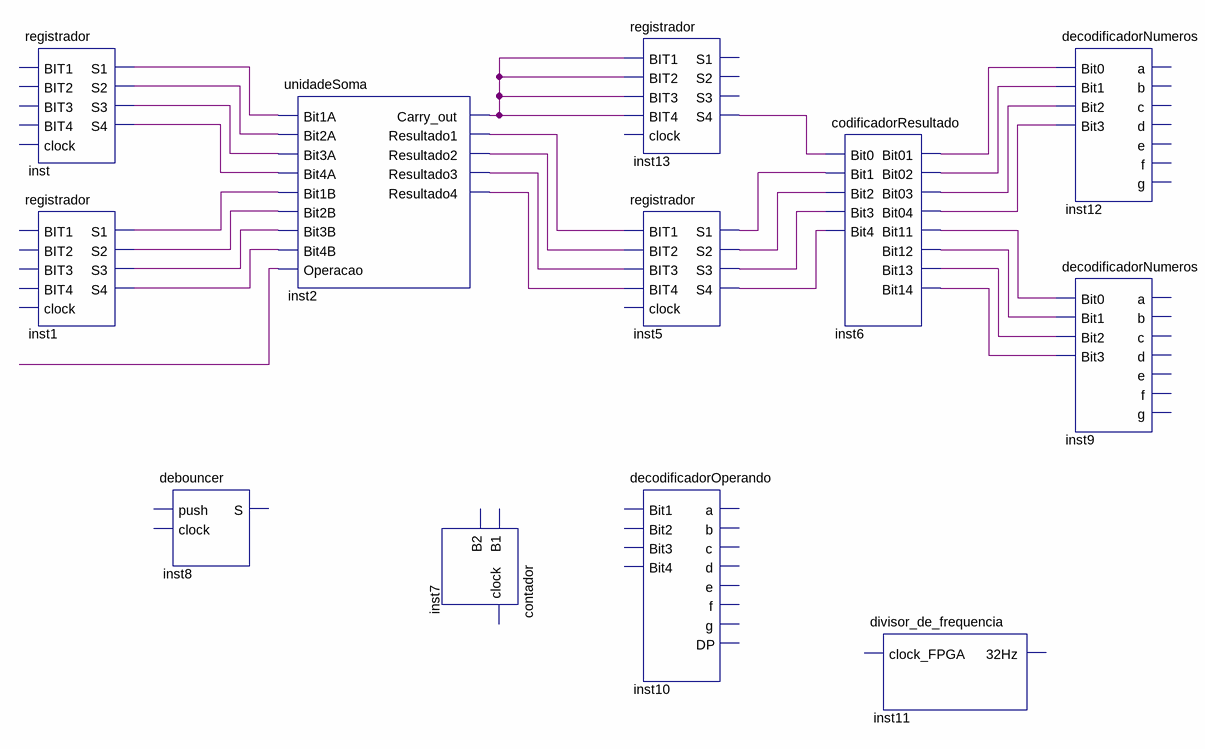
[diagram p0: schematic sheet]
// Quartus schematic Calculadora.bdf as structural Verilog: 12 symbols, 0 pins
module Calculadora (
);

  wire inst1_s1, inst1_s2, inst1_s3, inst1_s4, inst2_carry_out, inst2_resultado1, inst2_resultado2,
       inst2_resultado3, inst2_resultado4, inst5_s1, inst5_s2, inst5_s3, inst5_s4, inst6_bit01, inst6_bit02,
       inst6_bit03, inst6_bit04, inst6_bit11, inst6_bit12, inst6_bit13, inst6_bit14, inst13_s4, inst_s1,
       inst_s2, inst_s3, inst_s4, undriven;

  registrador inst (.S1(inst_s1), .S2(inst_s2), .S3(inst_s3), .S4(inst_s4));  // open: BIT1, BIT2, BIT3, BIT4, clock
  registrador inst1 (
    .S1(inst1_s1), .S2(inst1_s2), .S3(inst1_s3), .S4(inst1_s4));  // open: BIT1, BIT2, BIT3, BIT4, clock
  debouncer inst8 ();  // open: push, clock, S
  unidadeSoma inst2 (
    .Bit1A(inst_s1), .Bit2A(inst_s2), .Bit3A(inst_s3), .Bit4A(inst_s4), .Bit1B(inst1_s1), .Bit2B(inst1_s2),
    .Bit3B(inst1_s3), .Bit4B(inst1_s4), .Operacao(undriven), .Carry_out(inst2_carry_out),
    .Resultado1(inst2_resultado1), .Resultado2(inst2_resultado2), .Resultado3(inst2_resultado3),
    .Resultado4(inst2_resultado4));
  contador inst7 ();  // open: clock, B1, B2
  registrador inst13 (
    .BIT1(inst2_carry_out), .BIT2(inst2_carry_out), .BIT3(inst2_carry_out), .BIT4(inst2_carry_out),
    .S4(inst13_s4));  // open: clock, S1, S2, S3
  registrador inst5 (
    .BIT1(inst2_resultado1), .BIT2(inst2_resultado2), .BIT3(inst2_resultado3), .BIT4(inst2_resultado4),
    .S1(inst5_s1), .S2(inst5_s2), .S3(inst5_s3), .S4(inst5_s4));  // open: clock
  decodificadorOperando inst10 ();  // open: Bit1, Bit2, Bit3, Bit4, a, b, c, d, e, f, g, DP
  codificadorResultado inst6 (
    .Bit0(inst13_s4), .Bit1(inst5_s1), .Bit2(inst5_s2), .Bit3(inst5_s3), .Bit4(inst5_s4),
    .Bit01(inst6_bit01), .Bit02(inst6_bit02), .Bit03(inst6_bit03), .Bit04(inst6_bit04), .Bit11(inst6_bit11),
    .Bit12(inst6_bit12), .Bit13(inst6_bit13), .Bit14(inst6_bit14));
  divisor_de_frequencia inst11 ();  // open: clock_FPGA, 32Hz
  decodificadorNumeros inst12 (
    .Bit0(inst6_bit01), .Bit1(inst6_bit02), .Bit2(inst6_bit03), .Bit3(inst6_bit04));  // open: a, b, c, d, e, f, g
  decodificadorNumeros inst9 (
    .Bit0(inst6_bit11), .Bit1(inst6_bit12), .Bit2(inst6_bit13), .Bit3(inst6_bit14));  // open: a, b, c, d, e, f, g
endmodule
